# EAGLE schematic openpowermeter (EAGLE 6.5.0)
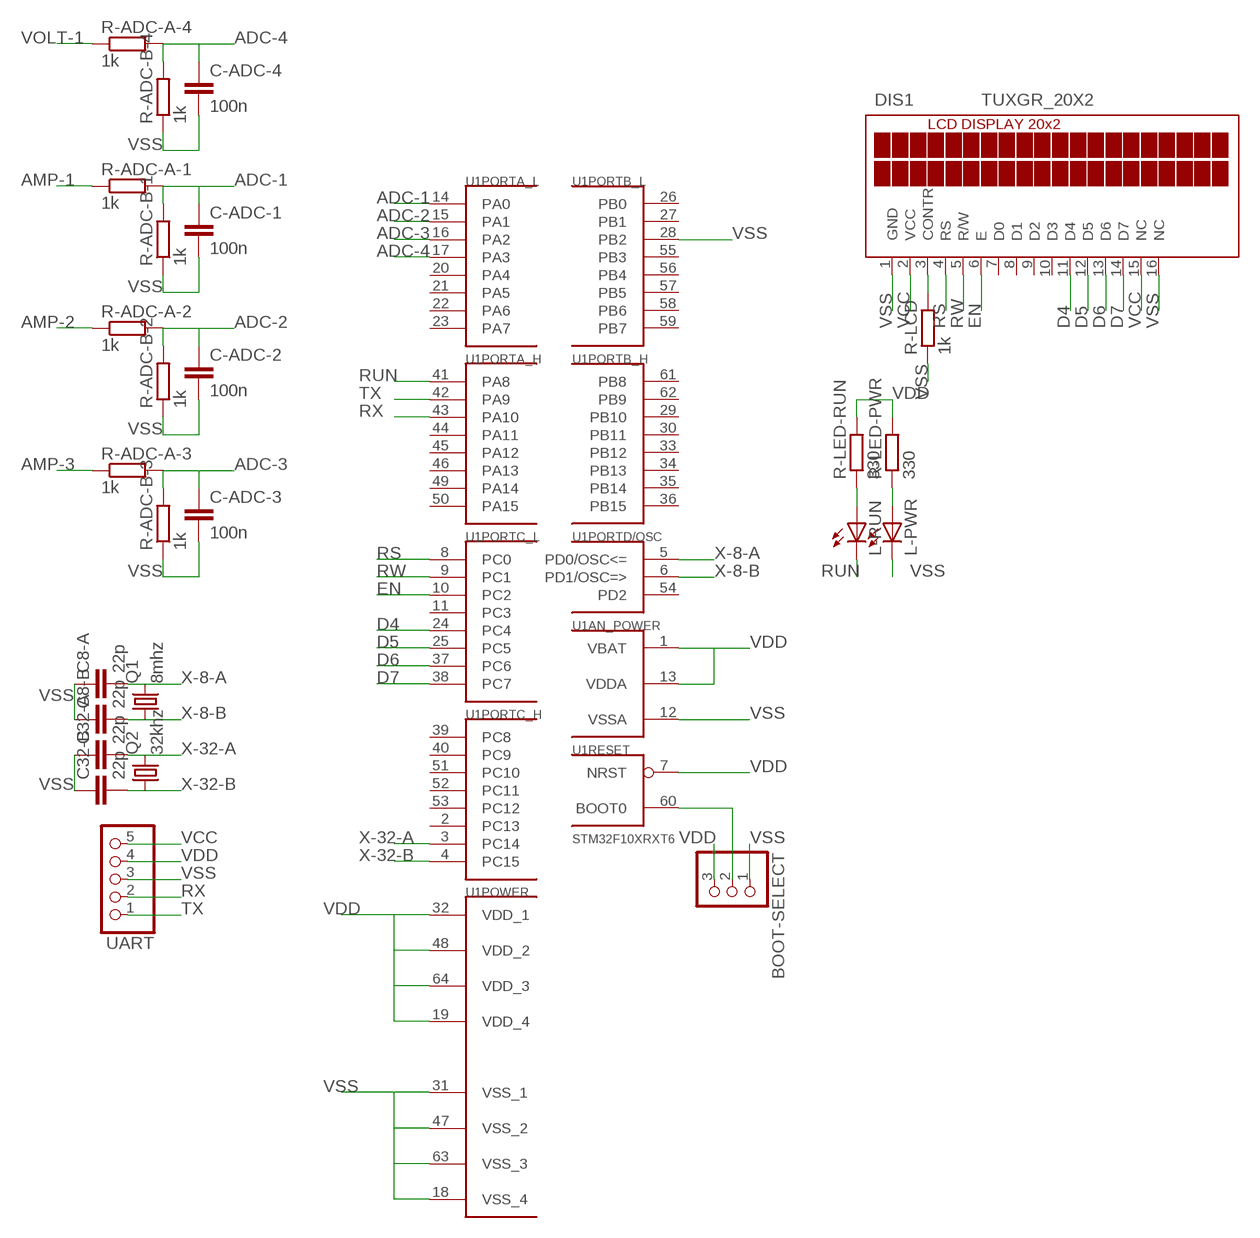
[diagram p0: schematic, sheet 1]

## Parts
BOOT-SELECT  PINHD-1X3  [1X03]
C8-A  22p  C-EUC1206  [C1206]
C8-B  22p  C-EUC1206  [C1206]
C32-A  22p  C-EUC1206  [C1206]
C32-B  22p  C-EUC1206  [C1206]
C-ADC-1  100n  C-EUC1206  [C1206]
C-ADC-2  100n  C-EUC1206  [C1206]
C-ADC-3  100n  C-EUC1206  [C1206]
C-ADC-4  100n  C-EUC1206  [C1206]
DIS1  TUXGR_20X2  [TUXGR_20X2]
L-PWR  LEDSML1206  [SML1206]
L-RUN  LEDSML1206  [SML1206]
Q1  8mhz  CRYSTALHC49S  [HC49/S]
Q2  32khz  CRYSTALTC26V  [TC26V]
R-ADC-A-1  1k  R-EU_R1206  [R1206]
R-ADC-A-2  1k  R-EU_R1206  [R1206]
R-ADC-A-3  1k  R-EU_R1206  [R1206]
R-ADC-A-4  1k  R-EU_R1206  [R1206]
R-ADC-B-1  1k  R-EU_R1206  [R1206]
R-ADC-B-2  1k  R-EU_R1206  [R1206]
R-ADC-B-3  1k  R-EU_R1206  [R1206]
R-ADC-B-4  1k  R-EU_R1206  [R1206]
R-LCD  1k  R-EU_R1206  [R1206]
R-LED-PWR  330  R-EU_R1206  [R1206]
R-LED-RUN  330  R-EU_R1206  [R1206]
U1  STM32F10XRXT6  [TQFP64]
UART  PINHD-1X5  [1X05]

## Nets
ADC-1: C-ADC-1.1 R-ADC-A-1.2 R-ADC-B-1.2 U1.14(PORTA_L:PA0)
ADC-2: C-ADC-2.1 R-ADC-A-2.2 R-ADC-B-2.2 U1.15(PORTA_L:PA1)
ADC-3: C-ADC-3.1 R-ADC-A-3.2 R-ADC-B-3.2 U1.16(PORTA_L:PA2)
ADC-4: C-ADC-4.1 R-ADC-A-4.2 R-ADC-B-4.2 U1.17(PORTA_L:PA3)
AMP-1: R-ADC-A-1.1
AMP-2: R-ADC-A-2.1
AMP-3: R-ADC-A-3.1
D4: DIS1.11(D4) U1.24(PORTC_L:PC4)
D5: DIS1.12(D5) U1.25(PORTC_L:PC5)
D6: DIS1.13(D6) U1.37(PORTC_L:PC6)
D7: DIS1.14(D7) U1.38(PORTC_L:PC7)
EN: DIS1.6(E) U1.10(PORTC_L:PC2)
N$1: BOOT-SELECT.2 U1.60(RESET:BOOT0)
N$3: L-PWR.A R-LED-PWR.1
N$4: DIS1.3(CONTR) R-LCD.2
N$6: L-RUN.A R-LED-RUN.1
RS: DIS1.4(RS) U1.8(PORTC_L:PC0)
RUN: L-RUN.C U1.41(PORTA_H:PA8)
RW: DIS1.5(R/W) U1.9(PORTC_L:PC1)
RX: U1.43(PORTA_H:PA10) UART.2
TX: U1.42(PORTA_H:PA9) UART.1
VCC: DIS1.2(VCC) DIS1.15(NC) UART.5
VDD: BOOT-SELECT.3 R-LED-PWR.2 R-LED-RUN.2 U1.1(AN_POWER:VBAT) U1.7(RESET:NRST) U1.13(AN_POWER:VDDA) U1.19(POWER:VDD_4) U1.32(POWER:VDD_1) U1.48(POWER:VDD_2) U1.64(POWER:VDD_3) UART.4
VOLT-1: R-ADC-A-4.1
VSS: BOOT-SELECT.1 C8-A.1 C8-B.1 C32-A.1 C32-B.1 C-ADC-1.2 C-ADC-2.2 C-ADC-3.2 C-ADC-4.2 DIS1.1(GND) DIS1.16(NC) L-PWR.C R-ADC-B-1.1 R-ADC-B-2.1 R-ADC-B-3.1 R-ADC-B-4.1 R-LCD.1 U1.12(AN_POWER:VSSA) U1.18(POWER:VSS_4) U1.28(PORTB_L:PB2) U1.31(POWER:VSS_1) U1.47(POWER:VSS_2) U1.63(POWER:VSS_3) UART.3
X-8-A: C8-A.2 Q1.2 U1.5(PORTD/OSC:PD0/OSC<=)
X-8-B: C8-B.2 Q1.1 U1.6(PORTD/OSC:PD1/OSC=>)
X-32-A: C32-A.2 Q2.2 U1.3(PORTC_H:PC14)
X-32-B: C32-B.2 Q2.1 U1.4(PORTC_H:PC15)
Unconnected: DIS1.7(D0) DIS1.8(D1) DIS1.9(D2) DIS1.10(D3) U1.2(PORTC_H:PC13) U1.11(PORTC_L:PC3) U1.20(PORTA_L:PA4) U1.21(PORTA_L:PA5) U1.22(PORTA_L:PA6) U1.23(PORTA_L:PA7) U1.26(PORTB_L:PB0) U1.27(PORTB_L:PB1) U1.29(PORTB_H:PB10) U1.30(PORTB_H:PB11) U1.33(PORTB_H:PB12) U1.34(PORTB_H:PB13) U1.35(PORTB_H:PB14) U1.36(PORTB_H:PB15) U1.39(PORTC_H:PC8) U1.40(PORTC_H:PC9) U1.44(PORTA_H:PA11) U1.45(PORTA_H:PA12) U1.46(PORTA_H:PA13) U1.49(PORTA_H:PA14) U1.50(PORTA_H:PA15) U1.51(PORTC_H:PC10) U1.52(PORTC_H:PC11) U1.53(PORTC_H:PC12) U1.54(PORTD/OSC:PD2) U1.55(PORTB_L:PB3) U1.56(PORTB_L:PB4) U1.57(PORTB_L:PB5) U1.58(PORTB_L:PB6) U1.59(PORTB_L:PB7) U1.61(PORTB_H:PB8) U1.62(PORTB_H:PB9)

## Library data of the parts
BOOT-SELECT = pinhead:PINHD-1X3: PIN HEADER
C8-A C8-B C32-A C32-B = resistor:C-EU: CAPACITOR, European symbol
C-ADC-1-C-ADC-4 = rcl:C-EU: CAPACITOR, European symbol
DIS1 = display-lcd:TUXGR_20X2: Tuxgraphics LCD display 20x2 characters reflective, without background light Source: tuxgr_20x2.pdf; OC_FARNELL: unknown; OC_NEWARK: unknown
L-PWR L-RUN = led:LED: LED OSRAM: - CHIPLED LG R971, LG N971, LY N971, LG Q971, LY Q971, LO R971, LY R971 LH N974, LH R974 LS Q976, LO Q976, LY Q976 LO Q996 - Hyper CHIPLED LW Q18S LB Q993, LB Q99A, LB R99A - SideLED LS A670, LO A670, LY A670, LG A670, LP A670 LB A673, LV A673, LT A673, LW A673 LH A674 LY A675 LS A676, LA A676, LO A676, LY A676, LW A676 LS A679, LY A679, LG A679 - Hyper Micro SIDELED® LS Y876, LA Y876, LO Y876, LY Y876 LT Y87S - SmartLED LW L88C, LW L88S LB L89C, LB L89S, LG L890 LS L89K, LO L89K, LY L89K LS L896, LA L896, LO L896, LY L896 - TOPLED LS T670, LO T670, LY T670, LG T670, LP T670 LSG T670, LSP T670, LSY T670, LOP T670, LYG T670 LG T671, LOG T671, LSG T671 LB T673, LV T673, LT T673, LW T673 LH T674 LS T676, LA T676, LO T676, LY T676, LB T676, LH T676, LSB T676, LW T676 LB T67C, LV T67C, LT T67C, LS T67K, LO T67K, LY T67K, LW E67C LS E67B, LA E67B, LO E67B, LY E67B, LB E67C, LV E67C, LT E67C LW T67C LS T679, LY T679, LG T679 LS T770, LO T770, LY T770, LG T770, LP T770 LB T773, LV T773, LT T773, LW T773 LH T774 LS E675, LA E675, LY E675, LS T675 LS T776, LA T776, LO T776, LY T776, LB T776 LHGB T686 LT T68C, LB T68C - Hyper Mini TOPLED® LB M676 - Mini TOPLED Santana® LG M470 LS M47K, LO M47K, LY M47K Source: http://www.osram.convergy.de LUXEON: - LUMILED® LXK2-PW12-R00, LXK2-PW12-S00, LXK2-PW14-U00, LXK2-PW14-V00 LXK2-PM12-R00, LXK2-PM12-S00, LXK2-PM14-U00 LXK2-PE12-Q00, LXK2-PE12-R00, LXK2-PE12-S00, LXK2-PE14-T00, LXK2-PE14-U00 LXK2-PB12-K00, LXK2-PB12-L00, LXK2-PB12-M00, LXK2-PB14-N00, LXK2-PB14-P00, LXK2-PB14-Q00 LXK2-PR12-L00, LXK2-PR12-M00, LXK2-PR14-Q00, LXK2-PR14-R00 LXK2-PD12-Q00, LXK2-PD12-R00, LXK2-PD12-S00 LXK2-PH12-R00, LXK2-PH12-S00 LXK2-PL12-P00, LXK2-PL12-Q00, LXK2-PL12-R00 Source: www.luxeon.com KINGBRIGHT: KA-3528ASYC Source: www.kingbright.com
Q1 = crystal:CRYSTAL: CRYSTAL; OC_FARNELL: 1667008; OC_NEWARK: unknown
Q2 = crystal:CRYSTAL: CRYSTAL; OC_FARNELL: unknown; OC_NEWARK: unknown
R-ADC-A-1-R-ADC-A-4 R-ADC-B-1-R-ADC-B-4 R-LCD R-LED-PWR R-LED-RUN = resistor:R-EU_: RESISTOR, European symbol
U1 = stm32:STM32F10XRXT6: STM32F101/103 64pin LQFP
UART = pinhead:PINHD-1X5: PIN HEADER